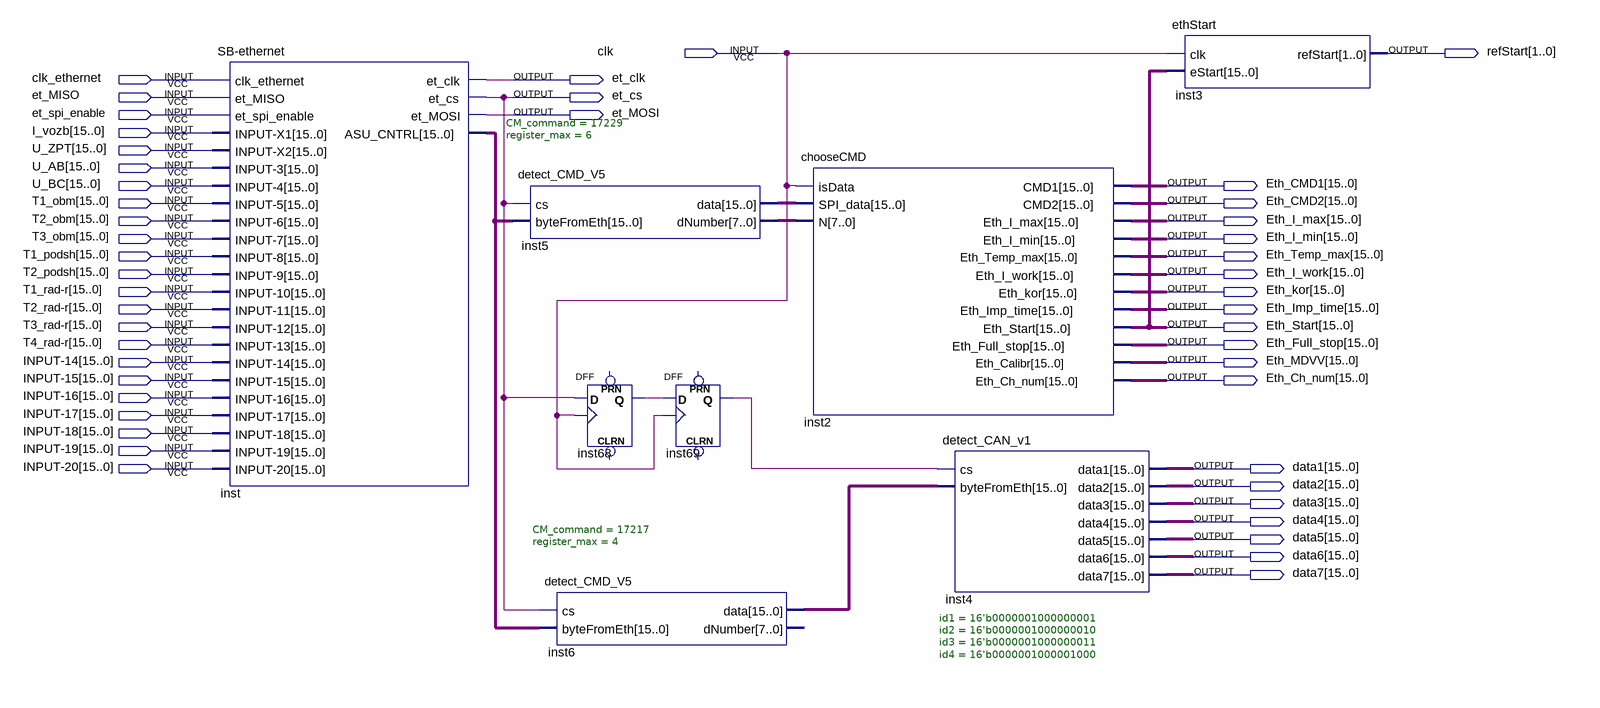
[diagram p0: schematic sheet]
// Quartus schematic SB-All-EthernetSPI_v1.bdf as structural Verilog: 8 symbols, 47 pins
module \SB-All-EthernetSPI_v1  (
  input  clk,
  input  clk_ethernet,
  input  et_MISO,
  input  et_spi_enable,
  input  [15:0] I_vozb,
  input  [15:0] U_ZPT,
  input  [15:0] U_AB,
  input  [15:0] U_BC,
  input  [15:0] T1_obm,
  input  [15:0] T2_obm,
  input  [15:0] T3_obm,
  input  [15:0] T1_podsh,
  input  [15:0] T2_podsh,
  input  [15:0] \T1_rad-r ,
  input  [15:0] \T2_rad-r ,
  input  [15:0] \T3_rad-r ,
  input  [15:0] \T4_rad-r ,
  input  [15:0] \INPUT-14 ,
  input  [15:0] \INPUT-15 ,
  input  [15:0] \INPUT-16 ,
  input  [15:0] \INPUT-17 ,
  input  [15:0] \INPUT-18 ,
  input  [15:0] \INPUT-19 ,
  input  [15:0] \INPUT-20 ,
  output [1:0] refStart,
  output et_clk,
  output et_cs,
  output et_MOSI,
  output [15:0] Eth_CMD1,
  output [15:0] Eth_CMD2,
  output [15:0] Eth_I_max,
  output [15:0] Eth_I_min,
  output [15:0] Eth_Temp_max,
  output [15:0] Eth_I_work,
  output [15:0] Eth_kor,
  output [15:0] Eth_Imp_time,
  output [15:0] Eth_Start,
  output [15:0] Eth_Full_stop,
  output [15:0] Eth_MDVV,
  output [15:0] Eth_Ch_num,
  output [15:0] data1,
  output [15:0] data2,
  output [15:0] data3,
  output [15:0] data4,
  output [15:0] data5,
  output [15:0] data6,
  output [15:0] data7
);

  wire inst68_q, inst69_q;
  wire [7:0] inst5_dnumber;
  wire [15:0] inst5_data, inst6_data, inst_asu_cntrl;

  \SB-ethernet  inst (
    .clk_ethernet(clk_ethernet), .et_MISO(et_MISO), .et_spi_enable(et_spi_enable), .\INPUT-X1 (I_vozb),
    .\INPUT-X2 (U_ZPT), .\INPUT-3 (U_AB), .\INPUT-4 (U_BC), .\INPUT-5 (T1_obm), .\INPUT-6 (T2_obm),
    .\INPUT-7 (T3_obm), .\INPUT-8 (T1_podsh), .\INPUT-9 (T2_podsh), .\INPUT-10 (\T1_rad-r ),
    .\INPUT-11 (\T2_rad-r ), .\INPUT-12 (\T3_rad-r ), .\INPUT-13 (\T4_rad-r ), .\INPUT-14 (\INPUT-14 ),
    .\INPUT-15 (\INPUT-15 ), .\INPUT-16 (\INPUT-16 ), .\INPUT-17 (\INPUT-17 ), .\INPUT-18 (\INPUT-18 ),
    .\INPUT-19 (\INPUT-19 ), .\INPUT-20 (\INPUT-20 ), .et_clk(et_clk), .et_cs(et_cs), .et_MOSI(et_MOSI),
    .ASU_CNTRL(inst_asu_cntrl));
  detect_CMD_V5 #(.CM_command(17229), .register_max(6)) inst5 (
    .cs(et_cs), .byteFromEth(inst_asu_cntrl), .data(inst5_data), .dNumber(inst5_dnumber));
  DFF inst68 (.CLK(clk), .D(et_cs), .Q(inst68_q));  // open: CLRN, PRN
  detect_CMD_V5 #(.CM_command(17217), .register_max(4)) inst6 (
    .cs(et_cs), .byteFromEth(inst_asu_cntrl), .data(inst6_data));  // open: dNumber
  DFF inst69 (.CLK(clk), .D(inst68_q), .Q(inst69_q));  // open: CLRN, PRN
  chooseCMD inst2 (
    .isData(clk), .SPI_data(inst5_data), .N(inst5_dnumber), .CMD1(Eth_CMD1), .CMD2(Eth_CMD2),
    .Eth_I_max(Eth_I_max), .Eth_I_min(Eth_I_min), .Eth_Temp_max(Eth_Temp_max), .Eth_I_work(Eth_I_work),
    .Eth_kor(Eth_kor), .Eth_Imp_time(Eth_Imp_time), .Eth_Start(Eth_Start), .Eth_Full_stop(Eth_Full_stop),
    .Eth_Calibr(Eth_MDVV), .Eth_Ch_num(Eth_Ch_num));
  detect_CAN_v1 #(.id1(16'b0000001000000001), .id2(16'b0000001000000010), .id3(16'b0000001000000011), .id4(16'b0000001000001000)) inst4 (
    .cs(inst69_q), .byteFromEth(inst6_data), .data1(data1), .data2(data2), .data3(data3), .data4(data4),
    .data5(data5), .data6(data6), .data7(data7));
  ethStart inst3 (.clk(clk), .eStart(Eth_Start), .refStart(refStart));
endmodule
